# EAGLE design DIGISPARK (EAGLE 7.2.0)
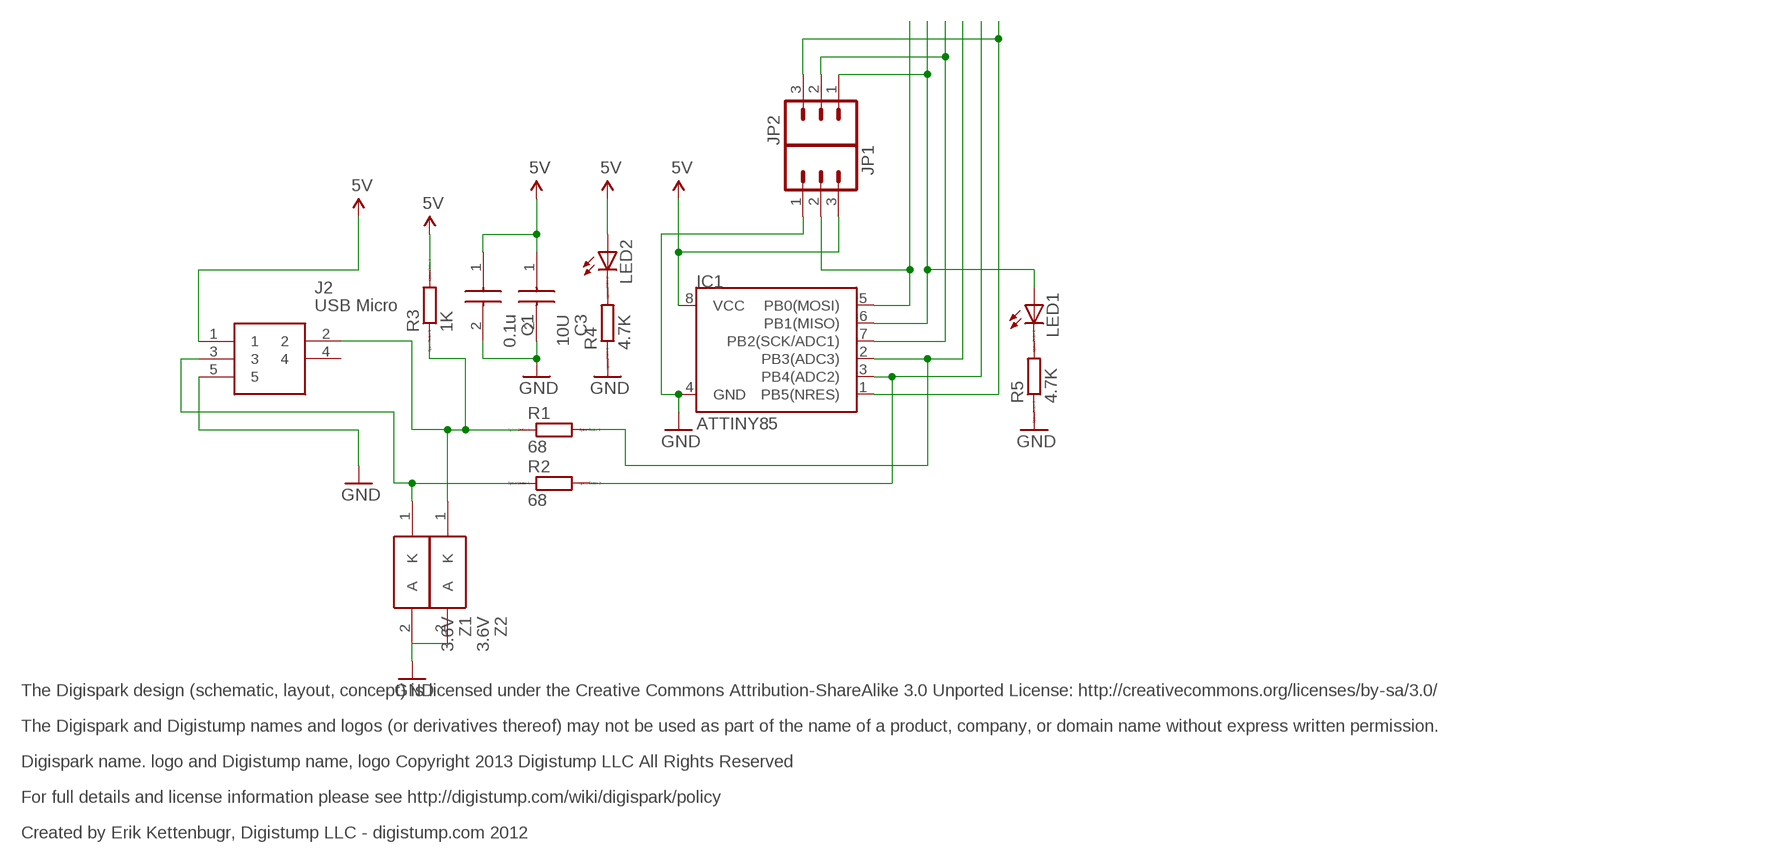
[diagram p0: schematic, sheet 1]

## Parts
C1  0.1u  GRM2165C1H220JZ01D  [CAPC2012X70N]
C3  10U  GRM2165C1H220JZ01D  [CAPC2012X70N]
IC1  ATTINY85  ATTINY45  [SO08-EIAJ]
J2  USB Micro  10104110-0001LF  [10104110-0001LF]
JP1  M03PTH  [1X03]
JP2  M03PTH  [1X03]
LED1  LEDCHIPLED_0805  [CHIPLED_0805]
LED2  LEDCHIPLED_0805  [CHIPLED_0805]
R1  68  RR2012  [R2012]
R2  68  RR2012  [R2012]
R3  1K  RR2012  [R2012]
R4  4.7K  RR2012  [R2012]
R5  4.7K  RR2012  [R2012]
Z1  3.6V  TFZVTR15B  [TUM-D2]
Z2  3.6V  TFZVTR15B  [TUM-D2]

## Nets
5V: C1.1 C3.1 IC1.8(VCC) J2.1 JP1.3 LED2.A R3.2
GND: C1.2 C3.2 IC1.4(GND) J2.5 JP1.1 R4.1 R5.1 Z1.2(A) Z2.2(A)
N$1: IC1.2(PB3(ADC3)) R1.2
N$2: IC1.6(PB1(MISO)) JP2.1 LED1.A
N$3: IC1.5(PB0(MOSI)) JP1.2
N$4: LED1.C R5.2
N$5: IC1.7(PB2(SCK/ADC1)) JP2.2
N$6: IC1.3(PB4(ADC2)) R2.2
N$7: LED2.C R4.2
N$8: IC1.1(PB5(NRES)) JP2.3
N$10: J2.2 R1.1 R3.1 Z2.1(K)
N$11: J2.3 R2.1 Z1.1(K)
Unconnected: J2.4

## Notes on the sheet
- The Digispark design (schematic, layout, concept) is licensed under the Creative Commons Attribution-ShareAlike 3.0 Unported License: http://creativecommons.org/licenses/by-sa/3.0/
- The Digispark and Digistump names and logos (or derivatives thereof) may not be used as part of the name of a product, company, or domain name without express written permission.
- Digispark name. logo and Digistump name, logo Copyright 2013 Digistump LLC All Rights Reserved
- For full details and license information please see http://digistump.com/wiki/digispark/policy
- Created by Erik Kettenbugr, Digistump LLC - digistump.com 2012

## Library data of the parts
C1 C3 = GRM2165C1H220JZ01D:GRM2165C1H220JZ01D: MURATA - GRM2165C1H220JZ01D - CAP, MLCC, C0G/NP0, 22PF, 50V, 0805 Source: Datasheet <http://www.murata.com/~/media/webrenewal/support/library/catalog/products/capacitor/mlcc/c02e.pdf>; ARROW_PART_NUMBER: GRM2165C1H220JZ01D; ARROW_PRICE-STOCK: https://www.arrow.com/en/products/grm2165c1h220jz01d/murata-manufacturing; DESCRIPTION: MURATA - GRM2165C1H220JZ01D - CAP, MLCC, C0G/NP0, 22PF, 50V, 0805; HEIGHT: 0.7mm; MANUFACTURER_NAME: Murata Electronics; MANUFACTURER_PART_NUMBER: GRM2165C1H220JZ01D; RS_PART_NUMBER: 7236243; RS_PRICE-STOCK: http://uk.rs-online.com/web/p/products/7236243
IC1 = SparkFun:ATTINY45: Atmel ATTiny45
J2 = USB-Micro_3:10104110-0001LF: USB Connectors 5P Quick Connect Micro USB TypeB Rcpt Source: Datasheet <http://docs-emea.rs-online.com/webdocs/0ed1/0900766b80ed1ae6.pdf>; ALLIED_NUMBER: 70236824; ALLIED_PRICE-STOCK: http://www.alliedelec.com/fci-10104110-0001lf/70236824/; ARROW_PART_NUMBER: 10104110-0001LF; ARROW_PRICE-STOCK: https://www.arrow.com/en/products/10104110-0001lf/amphenol-fci; DESCRIPTION: USB Connectors 5P Quick Connect Micro USB TypeB Rcpt; HEIGHT: mm; MANUFACTURER_NAME: FCI; MANUFACTURER_PART_NUMBER: 10104110-0001LF; RS_PART_NUMBER: 1738645; RS_PRICE-STOCK: http://uk.rs-online.com/web/p/products/1738645
JP1 JP2 = SparkFun:M03: Header 3 Standard 3-pin 0.1" header. Use with straight break away headers (SKU : PRT-00116), right angle break away headers (PRT-00553), swiss pins (PRT-00743), machine pins (PRT-00117), and female headers (PRT-00115). Molex polarized connector foot print use with SKU : PRT-08232 with associated crimp pins and housings.
LED1 LED2 = adafruit:LED: LED OSRAM: - CHIPLED LG R971, LG N971, LY N971, LG Q971, LY Q971, LO R971, LY R971 LH N974, LH R974 LS Q976, LO Q976, LY Q976 LO Q996 - Hyper CHIPLED LW Q18S LB Q993, LB Q99A, LB R99A - SideLED LS A670, LO A670, LY A670, LG A670, LP A670 LB A673, LV A673, LT A673, LW A673 LH A674 LY A675 LS A676, LA A676, LO A676, LY A676, LW A676 LS A679, LY A679, LG A679 - Hyper Micro SIDELED® LS Y876, LA Y876, LO Y876, LY Y876 LT Y87S - SmartLED LW L88C, LW L88S LB L89C, LB L89S, LG L890 LS L89K, LO L89K, LY L89K LS L896, LA L896, LO L896, LY L896 - TOPLED LS T670, LO T670, LY T670, LG T670, LP T670 LSG T670, LSP T670, LSY T670, LOP T670, LYG T670 LG T671, LOG T671, LSG T671 LB T673, LV T673, LT T673, LW T673 LH T674 LS T676, LA T676, LO T676, LY T676, LB T676, LH T676, LSB T676, LW T676 LB T67C, LV T67C, LT T67C, LS T67K, LO T67K, LY T67K, LW E67C LS E67B, LA E67B, LO E67B, LY E67B, LB E67C, LV E67C, LT E67C LW T67C LS T679, LY T679, LG T679 LS T770, LO T770, LY T770, LG T770, LP T770 LB T773, LV T773, LT T773, LW T773 LH T774 LS E675, LA E675, LY E675, LS T675 LS T776, LA T776, LO T776, LY T776, LB T776 LHGB T686 LT T68C, LB T68C - Hyper Mini TOPLED® LB M676 - Mini TOPLED Santana® LG M470 LS M47K, LO M47K, LY M47K Source: http://www.osram.convergy.de/
R1-R5 = eagle-ltspice:R: RESISTOR, European symbol; SPICEMODEL: NONE; SPICEPREFIX: R
Z1 Z2 = TFZVTR15B:TFZVTR15B: ROHM - TFZVTR15B - ZENER DIODE, 0.5W, SOD-323HE Source: Datasheet <http://www.farnell.com/datasheets/2300201.pdf>; ARROW_PART_NUMBER: TFZVTR15B; ARROW_PRICE-STOCK: http://uk.rs-online.com/web/p/products/1715293; DESCRIPTION: ROHM - TFZVTR15B - ZENER DIODE, 0.5W, SOD-323HE; HEIGHT: mm; MANUFACTURER_NAME: ROHM Semiconductor; MANUFACTURER_PART_NUMBER: TFZVTR15B; RS_PART_NUMBER: 1715293; RS_PRICE-STOCK: http://uk.rs-online.com/web/p/products/1715293

## Net classes
0 default: width 0.4 mm

## Board
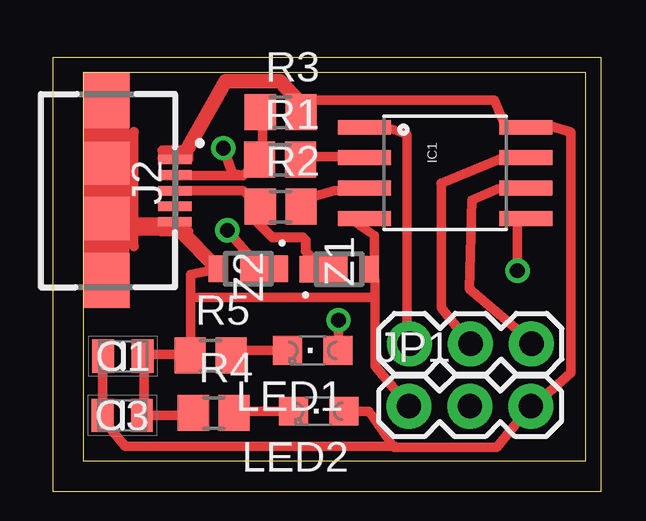
[diagram p1: board, top side]
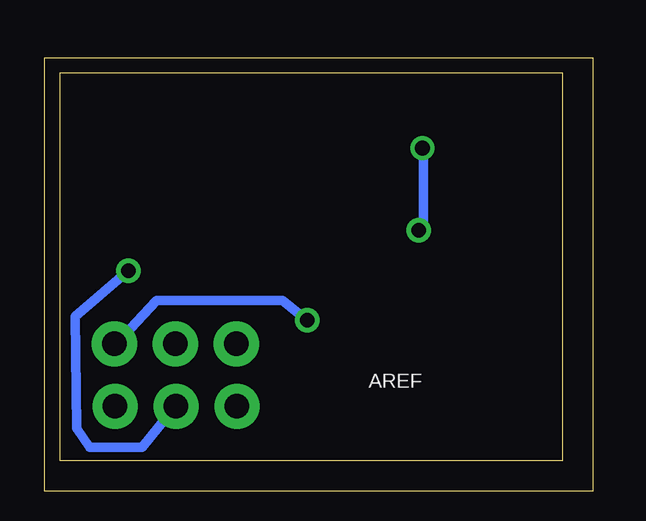
[diagram p2: board, bottom side, seen from below]

Size 20.95 x 16.19 mm. Coordinates in mm from the lower left corner, seen from the top.
Outline: 0,0 20.95,0 20.95,16.19 0,16.19 0,0
Copper layers (1*16): Top 0.035mm / dielectric 1.5mm / Bottom 0.035mm
Design rules "default *": minimum track width 10mil, minimum drill 24mil, track to track 6mil, track to pad 6mil, pad to pad 6mil, via to via 6mil, smd to smd 6mil, copper to edge 40mil, drill to drill 8mil, minimum pad ring 10mil, minimum via ring 8mil, stop-mask expansion 4mil, vias tented up to drill 0mil, thermal gap 10mil
Milling: 4 lines

### Footprints (pad centres in the part's own frame; a part is rotated, then mirrored left to right if it is on the bottom)
CAPC2012X70N = smd 0.91 x 1.39: 1 -0.82,0; 2 0.82,0
SO08-EIAJ = smd 0.61 x 2.21: 1 -1.905,-3.378; 2 -0.635,-3.378; 3 0.635,-3.378; 4 1.905,-3.378; 5 1.905,3.353; 6 0.635,3.353; 7 -0.635,3.353; 8 -1.905,3.353
10104110-0001LF = smd 0.4 x 1.4: 1 2.73,5.6; 2 3.38,5.6; 3 4.03,5.6; 4 4.68,5.6; 5 5.33,5.6 | smd 2.3 x 1.9: 6 0.28,2.75; 7 7.78,2.75 | smd 1.8 x 1.9: 8 2.88,2.75; 9 5.18,2.75
1X03 = drill 1.016 pad 1.88: 1 0,0; 2 2.54,0; 3 5.08,0
CHIPLED_0805 = smd 1.2 x 1.2: A 0,-1.05; C 0,1.05
R2012 = smd 1.3 x 1.5: 1 -0.85,0; 2 0.85,0
TUM-D2 = smd 1.1 x 2: 1 0,0 | smd 1.1 x 0.8: 2 0,1.9

### Placement (x,y rotation side)
C1  1.65,4.37 0 top
C3  1.62,1.91 0 top
IC1  15.1,12.02 270 top
J2  -1.78,15.3 270 top
JP1  13.58,2.29 0 top
JP2  18.68,4.89 180 top
LED1  9.56,4.61 90 top
LED2  9.81,2.08 90 top
R1  8.2,12.56 0 top
R2  8.22,10.61 0 top
R3  8.22,14.55 0 top
R4  5.44,2.01 0 top
R5  5.3,4.4 0 top
Z1  10.01,7.99 270 top
Z2  7.52,8.01 90 top

### Tracks (layer width: path | path; a pad name or v marks a point on that pad's centre or on a via)
5V
  Top 0.4: 4.29,12.92 3.97,12.7 J2.1 | 9.05,14.92 9.05,14.61 R3.2 9.4,15.05 17.14,15.05 17.59,13.97 17.94,13.97 IC1.8 18.41,13.97 19.49,13.97 20.32,13.72 20.32,3.68 19.05,2.54 JP1.3 18.57,2.22 17.24,0.57 12.95,0.57 | 12.95,0.57 11.91,2.06 10.95,2.06 LED2.A | 12.95,0.57 13.02,0.6 1.75,0.6 0.79,1.75 C3.1 0.79,4.29 C1.1 0.79,4.45
  Top 0.6: 4.29,12.92 5.94,15.84 8.19,15.84 9.05,14.92
GND
  Top 0.4: 5.56,8.26 5.56,7.94 Z2.2 4.48,7.78 4.48,6.83 | 3.97,9.84 J2.5 | R4.1 4.45,1.91 C3.2 2.54,2.06 2.54,4.29 C1.2 2.54,4.45 4.45,4.45 R5.1 4.45,4.6 4.48,5.59 4.48,6.83 | IC1.4 11.27,10 12.13,9.4 12.13,7.81 Z1.2 12.16,7.56 12.16,6.83 | 12.16,6.83 12.16,3.97 13.49,2.38 JP1.1 | 12.16,6.83 4.48,6.83
  Top 0.61: 3.97,9.84 3.97,9.67 Z2.2
N$1
  Top 0.4: R1.2 9.05,12.7 11.11,12.7 IC1.2
N$2  (via drill 0.61)
  Top 0.4: v10.64,5.87 10.64,4.76 LED1.A | IC1.6 17.27,11.34 16.19,10.89 16.1,7.18 18.73,4.92 JP2.1
  Bottom 0.4: v10.64,5.87 10.67,5.87 11.68,6.7 16.92,6.7 18.57,4.92 JP2.1
N$3  (via drill 0.61)
  Top 0.4: v18.1,7.94 18.1,10 IC1.5
  Bottom 0.4: v18.1,7.94 20.32,6.03 20.26,1.36 19.72,0.57 17.53,0.57 16.19,2.22 JP1.2
N$4
  Top 0.4: LED1.C 8.41,4.6 6.35,4.6 6.19,4.45 R5.2
N$5
  Top 0.4: 14.92,11.59 14.92,6.38 JP2.2 | 17.56,12.67 IC1.7
  Top 0.406: 14.92,11.59 17.56,12.67
N$6
  Top 0.4: R2.2 9.21,10.64 9.53,11.02 10.48,11.27 11.11,11.27 IC1.3
N$7
  Top 0.4: LED2.C 8.73,2.06 6.35,2.06 R4.2
N$8
  Top 0.4: IC1.1 11.27,13.81 12.61,13.94 13.49,13.62 13.49,4.92 JP2.3
N$9
  Top 0.406: 3.24,9.91 3.24,9.59 4.38,9.59
N$10  (via drill 0.61)
  Top 0.4: J2.2 3.97,11.91 6.67,11.91 7.3,12.54 R1.1 7.46,12.7 7.46,14.45 R3.1 | v6,9.62 7.46,7.94 Z2.1
  Top 0.406: 6.67,11.91 6.22,11.97 v5.84,13.05
  Bottom 0.4: v6,9.62 5.8,9.67 5.8,12.71 v5.84,13.05
N$11
  Top 0.4: J2.3 3.97,11.27 6.67,11.27 7.3,10.64 R2.1 7.3,10.48 | 9.84,7.94 Z1.1
  Top 0.406: 7.3,10.48 7.3,9.91 7.87,9.34 9.14,9.34 9.27,9.21 9.27,8.74 Z1.1
N$12
  Top 0.406: 4.38,12.57 4.38,12.95 3.3,12.95 3.3,12.64
N$13
  Top 1.93: 0.95,14.8 0.95,7.68
N$15
  Top 0.406: 2.1,8.95 2.1,13.72
N$16
  Top 0.406: 3.3,9.59 2.16,9.59 2.16,9.97 3.3,9.97 3.3,9.91

### Text on the board
bPlace: AREF